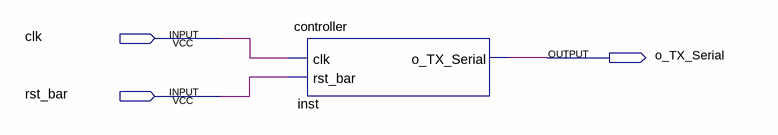
[diagram p0: schematic sheet]
// Quartus schematic TransmissionTest1.bdf as structural Verilog: 1 symbols, 3 pins
module TransmissionTest1 (
  input  clk,
  input  rst_bar,
  output o_TX_Serial
);

  controller inst (.clk(clk), .rst_bar(rst_bar), .o_TX_Serial(o_TX_Serial));
endmodule
